# EAGLE design LED_with_Regulator (EAGLE 7.7.0)
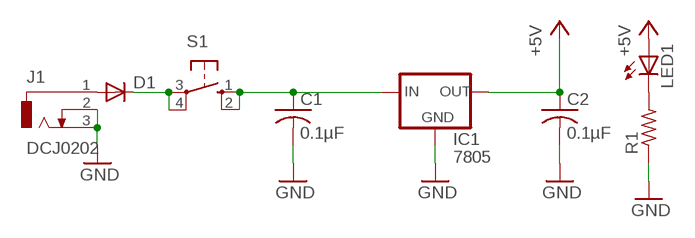
[diagram p0: schematic, sheet 1]

## Parts
C1  0.1µF  C-US025-025X050  [C025-025X050]
C2  0.1µF  C-US025-025X050  [C025-025X050]
D1  DIODE-D-7.5  [D-7.5]
IC1  7805  78XXL  [78XXL]
J1  DCJ0202  [DCJ0202]
LED1  LED5MM  [LED5MM]
R1  R-US_0204/5  [0204/5]
S1  10-XX  [B3F-10XX]

## Nets
+5V: C2.1 IC1.OUT LED1.A
GND: C1.2 C2.2 IC1.GND J1.2 J1.3 R1.1
N$2: D1.A J1.1
N$3: LED1.K(C) R1.2
N$4: D1.C S1.3(P) S1.4(P1)
N$5: C1.1 IC1.IN S1.1(S) S1.2(S1)

## Library data of the parts
C1 C2 = adafruit:C-US: CAPACITOR, American symbol
D1 = diode:DIODE-: DIODE
IC1 = v-reg:78XXL: VOLTAGE REGULATOR
J1 = con-jack:DCJ0202: DC POWER JACK Source: DCJ0202.pdf; OC_FARNELL: unknown; OC_NEWARK: unknown
LED1 = led:LED: LED OSRAM: - CHIPLED LG R971, LG N971, LY N971, LG Q971, LY Q971, LO R971, LY R971 LH N974, LH R974 LS Q976, LO Q976, LY Q976 LO Q996 - Hyper CHIPLED LW Q18S LB Q993, LB Q99A, LB R99A - SideLED LS A670, LO A670, LY A670, LG A670, LP A670 LB A673, LV A673, LT A673, LW A673 LH A674 LY A675 LS A676, LA A676, LO A676, LY A676, LW A676 LS A679, LY A679, LG A679 - Hyper Micro SIDELED® LS Y876, LA Y876, LO Y876, LY Y876 LT Y87S - SmartLED LW L88C, LW L88S LB L89C, LB L89S, LG L890 LS L89K, LO L89K, LY L89K LS L896, LA L896, LO L896, LY L896 - TOPLED LS T670, LO T670, LY T670, LG T670, LP T670 LSG T670, LSP T670, LSY T670, LOP T670, LYG T670 LG T671, LOG T671, LSG T671 LB T673, LV T673, LT T673, LW T673 LH T674 LS T676, LA T676, LO T676, LY T676, LB T676, LH T676, LSB T676, LW T676 LB T67C, LV T67C, LT T67C, LS T67K, LO T67K, LY T67K, LW E67C LS E67B, LA E67B, LO E67B, LY E67B, LB E67C, LV E67C, LT E67C LW T67C LS T679, LY T679, LG T679 LS T770, LO T770, LY T770, LG T770, LP T770 LB T773, LV T773, LT T773, LW T773 LH T774 LS E675, LA E675, LY E675, LS T675 LS T776, LA T776, LO T776, LY T776, LB T776 LHGB T686 LT T68C, LB T68C - Hyper Mini TOPLED® LB M676 - Mini TOPLED Santana® LG M470 LS M47K, LO M47K, LY M47K Source: http://www.osram.convergy.de LUXEON: - LUMILED® LXK2-PW12-R00, LXK2-PW12-S00, LXK2-PW14-U00, LXK2-PW14-V00 LXK2-PM12-R00, LXK2-PM12-S00, LXK2-PM14-U00 LXK2-PE12-Q00, LXK2-PE12-R00, LXK2-PE12-S00, LXK2-PE14-T00, LXK2-PE14-U00 LXK2-PB12-K00, LXK2-PB12-L00, LXK2-PB12-M00, LXK2-PB14-N00, LXK2-PB14-P00, LXK2-PB14-Q00 LXK2-PR12-L00, LXK2-PR12-M00, LXK2-PR14-Q00, LXK2-PR14-R00 LXK2-PD12-Q00, LXK2-PD12-R00, LXK2-PD12-S00 LXK2-PH12-R00, LXK2-PH12-S00 LXK2-PL12-P00, LXK2-PL12-Q00, LXK2-PL12-R00 Source: www.luxeon.com KINGBRIGHT: KA-3528ASYC Source: www.kingbright.com
R1 = adafruit:R-US_: RESISTOR, American symbol
S1 = switch-omron:10-XX: OMRON SWITCH; MPN: B3F-1000; OC_FARNELL: 176432; OC_NEWARK: 36M3542

## Board
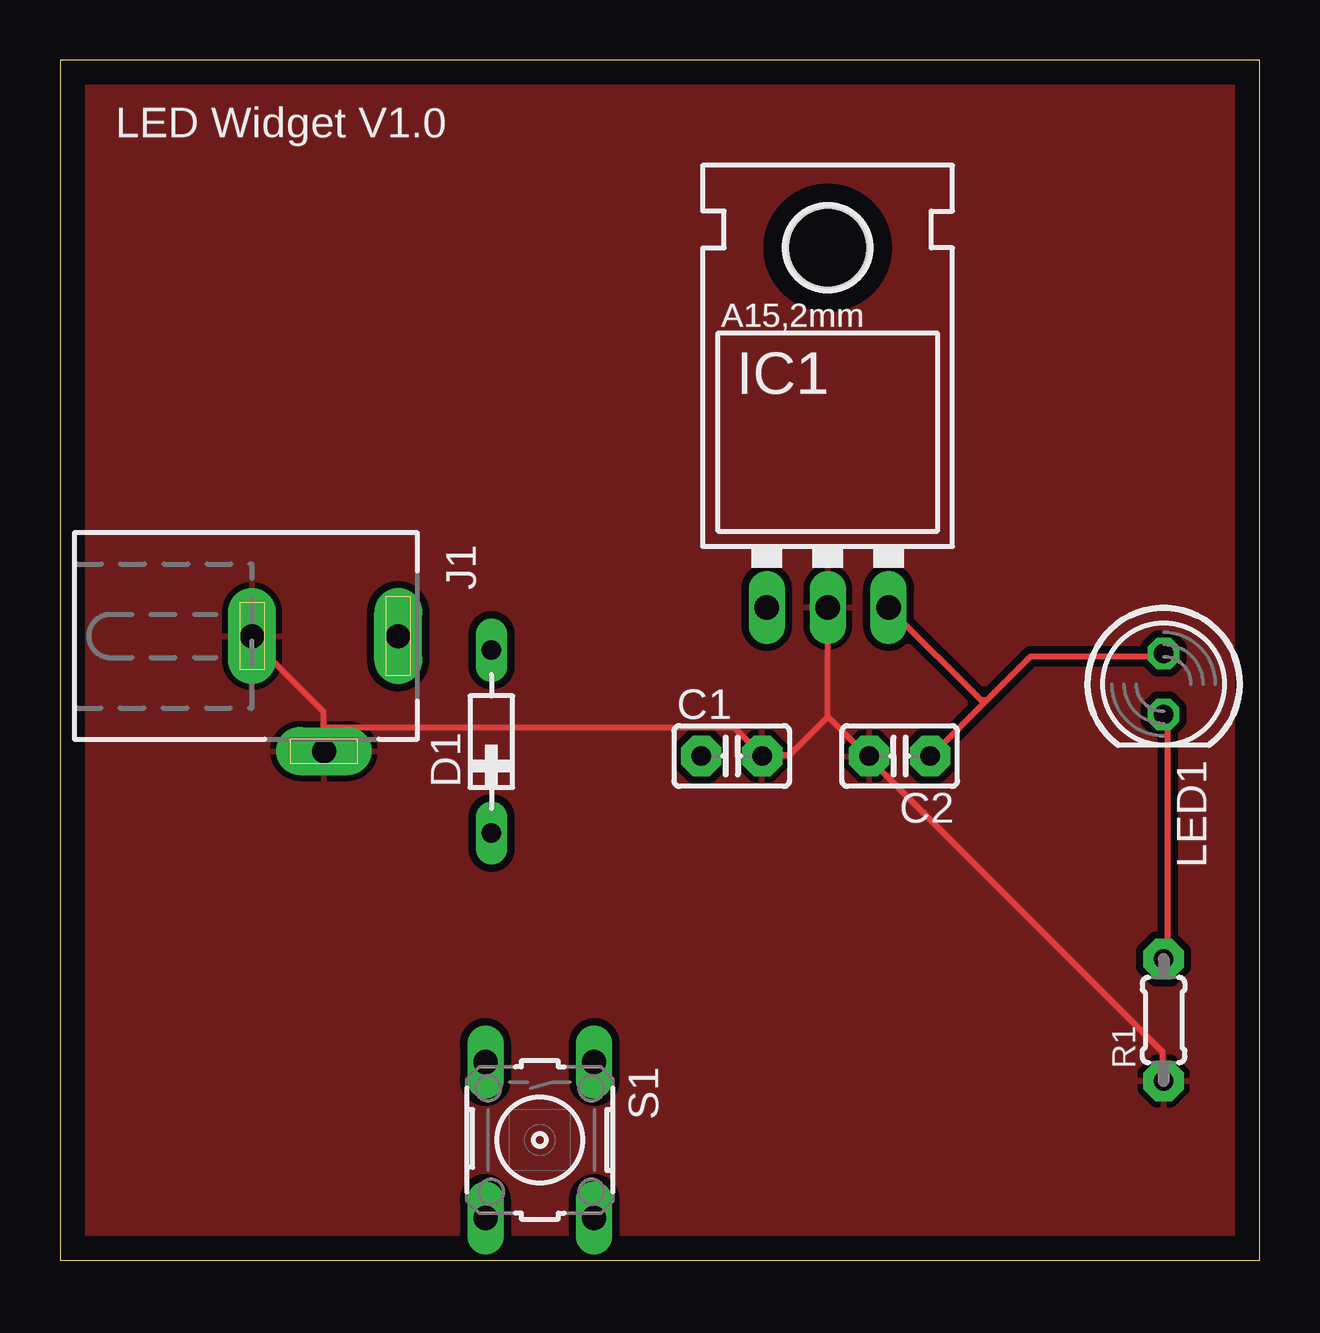
[diagram p1: board, top side]
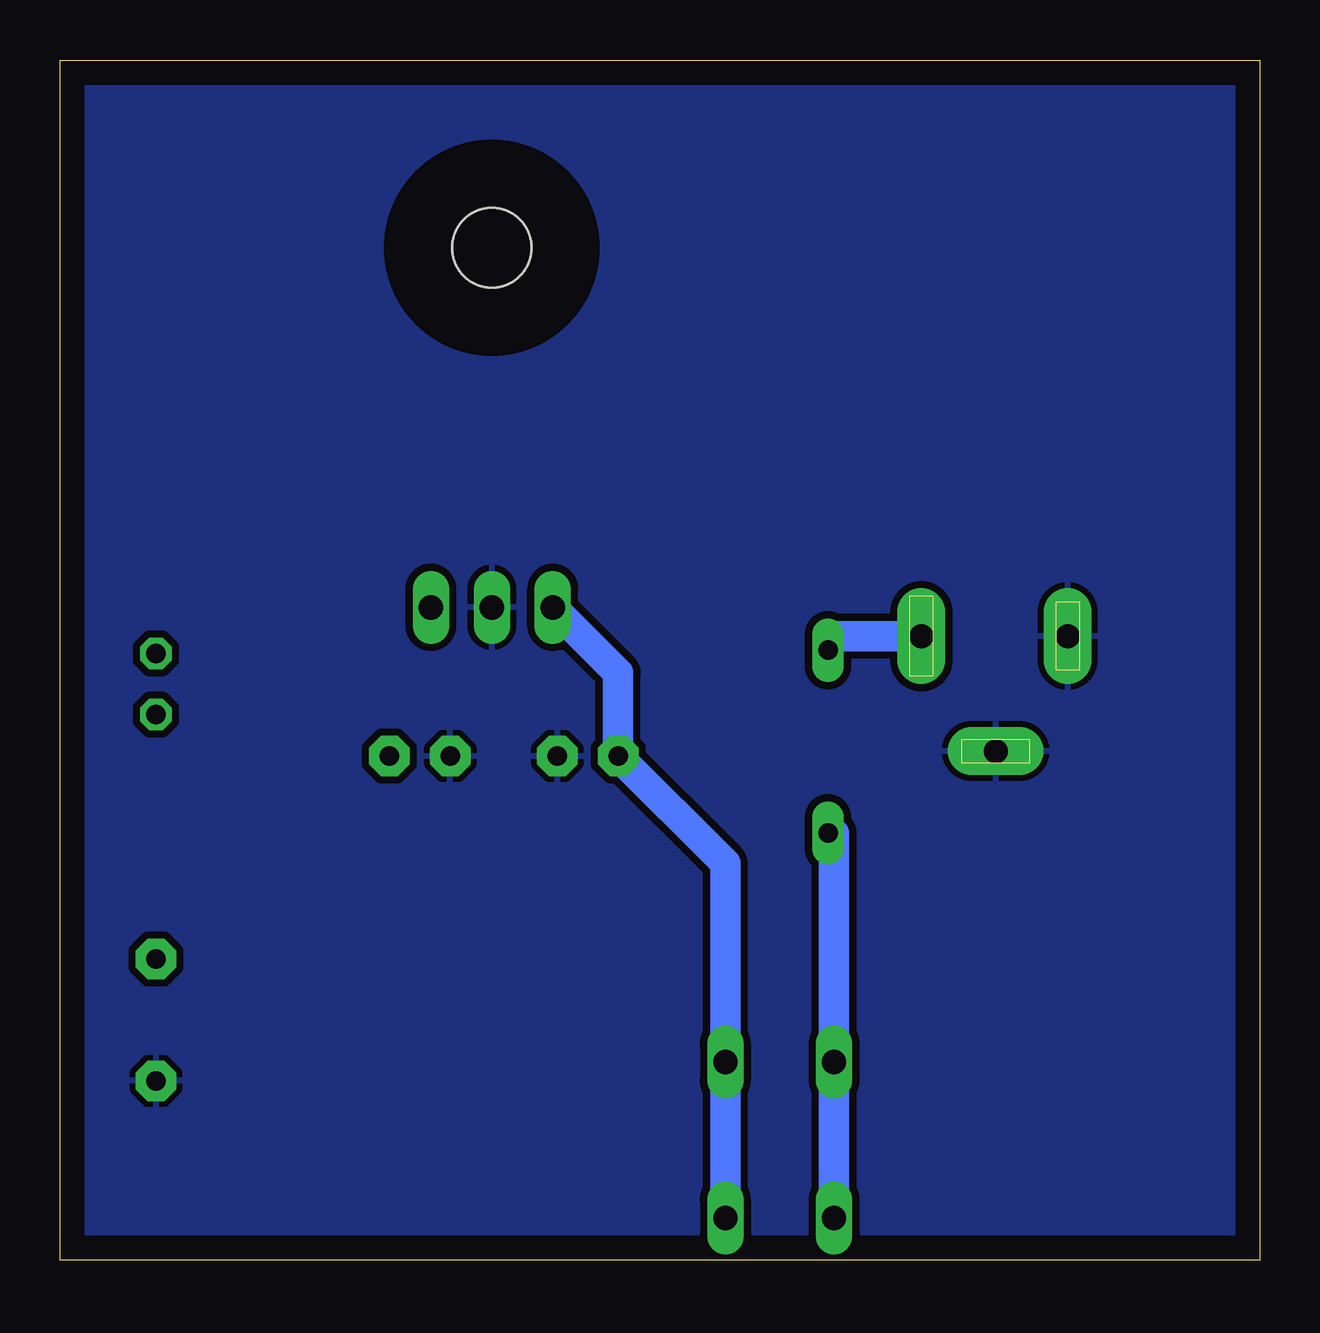
[diagram p2: board, bottom side, seen from below]

Size 50 x 50 mm. Coordinates in mm from the lower left corner, seen from the top.
Outline: 0,0 50,0 50,50 0,50 0,0
Copper layers (1*16): Top 0.035mm / dielectric 1.5mm / Bottom 0.035mm
Design rules "default": minimum track width 10mil, minimum drill 24mil, track to track 8mil, track to pad 8mil, pad to pad 8mil, via to via 8mil, smd to smd 8mil, copper to edge 40mil, drill to drill 8mil, minimum pad ring 10mil, minimum via ring 8mil, stop-mask expansion 4mil, vias tented up to drill 0mil, thermal gap 10mil

### Footprints (pad centres in the part's own frame; a part is rotated, then mirrored left to right if it is on the bottom)
C025-025X050 = drill 0.813 pad 1.676 octagon: 1 -1.27,0; 2 1.27,0
D-7.5 = drill 0.813 long: A 3.81,0; C -3.81,0
78XXL = drill 1.016 long: GND 0,-3.81; IN -2.54,-3.81; OUT 2.54,-3.81 | hole 3.302: 0,11.176
DCJ0202 = drill 1 pad 2 long: 1 0,3.1; 2 4.8,0; 3 0,-3
LED5MM = drill 0.813 octagon: A -1.27,0; K 1.27,0
0204/5 = drill 0.813 pad 1.676 octagon: 1 -2.54,0; 2 2.54,0
B3F-10XX = drill 1.016 long: 1 -3.251,2.261; 2 3.251,2.261; 3 -3.251,-2.261; 4 3.251,-2.261

### Placement (x,y rotation side)
C1  28,21 0 top
C2  35,21 180 top
D1  17.98,21.6 90 top
IC1  32,31 0 top
J1  11,26 270 top
LED1  46,24 270 top
R1  46,10 90 top
S1  20,5 270 top

### Tracks (layer width: path | path; a pad name or v marks a point on that pad's centre or on a via)
+5V
  Top 0.254: 38.63,23.32 36.35,21.03 C2.1 | 38.63,23.32 40.46,25.15 45.95,25.15 LED1.A | 38.63,23.32 38.41,23.32 34.75,26.98 IC1.OUT
GND
  Top 0.254: 10.97,22.17 10.97,22.86 8,25.83 J1.3 | 10.97,22.17 10.97,21.26 J1.2 10.97,22.17 | 32,22.63 32,26.98 IC1.GND | 32,22.63 33.6,21.03 C2.2 33.83,20.8 45.95,8.69 45.95,7.54 R1.1 | 32,22.63 30.4,21.03 29.49,21.03 C1.2 29.26,21.03 28.12,22.17 10.97,22.17
  pour Top (isolate 0.305): 0,49.96 0,0 49.96,0 49.96,49.78 49.96,49.96 0.89,49.96
  pour Bottom (isolate 0.305): 0,49.96 0,0 49.96,0 49.96,6.58 49.96,49.96
N$2
  Bottom 1.27: J1.1 17.98,26 D1.A
N$3
  Top 0.254: LED1.K 46.18,22.63 46.18,12.57 R1.2
N$4
  Bottom 0.254: S1.3 17.83,8.23 17.74,8.23
  Bottom 1.27: D1.C 17.74,17.79 S1.3 17.74,8.23 S1.4
N$5
  Bottom 1.27: S1.2 S1.1 22.26,16.53 C1.1 26.73,24.46 IC1.IN

### Text on the board
_tplace: LED Widget V1.0 | A15,2mm